# Altium schematic sheet DASHBOARD.SchDoc
size A4; SheetNumber: 1; SheetTotal: 4
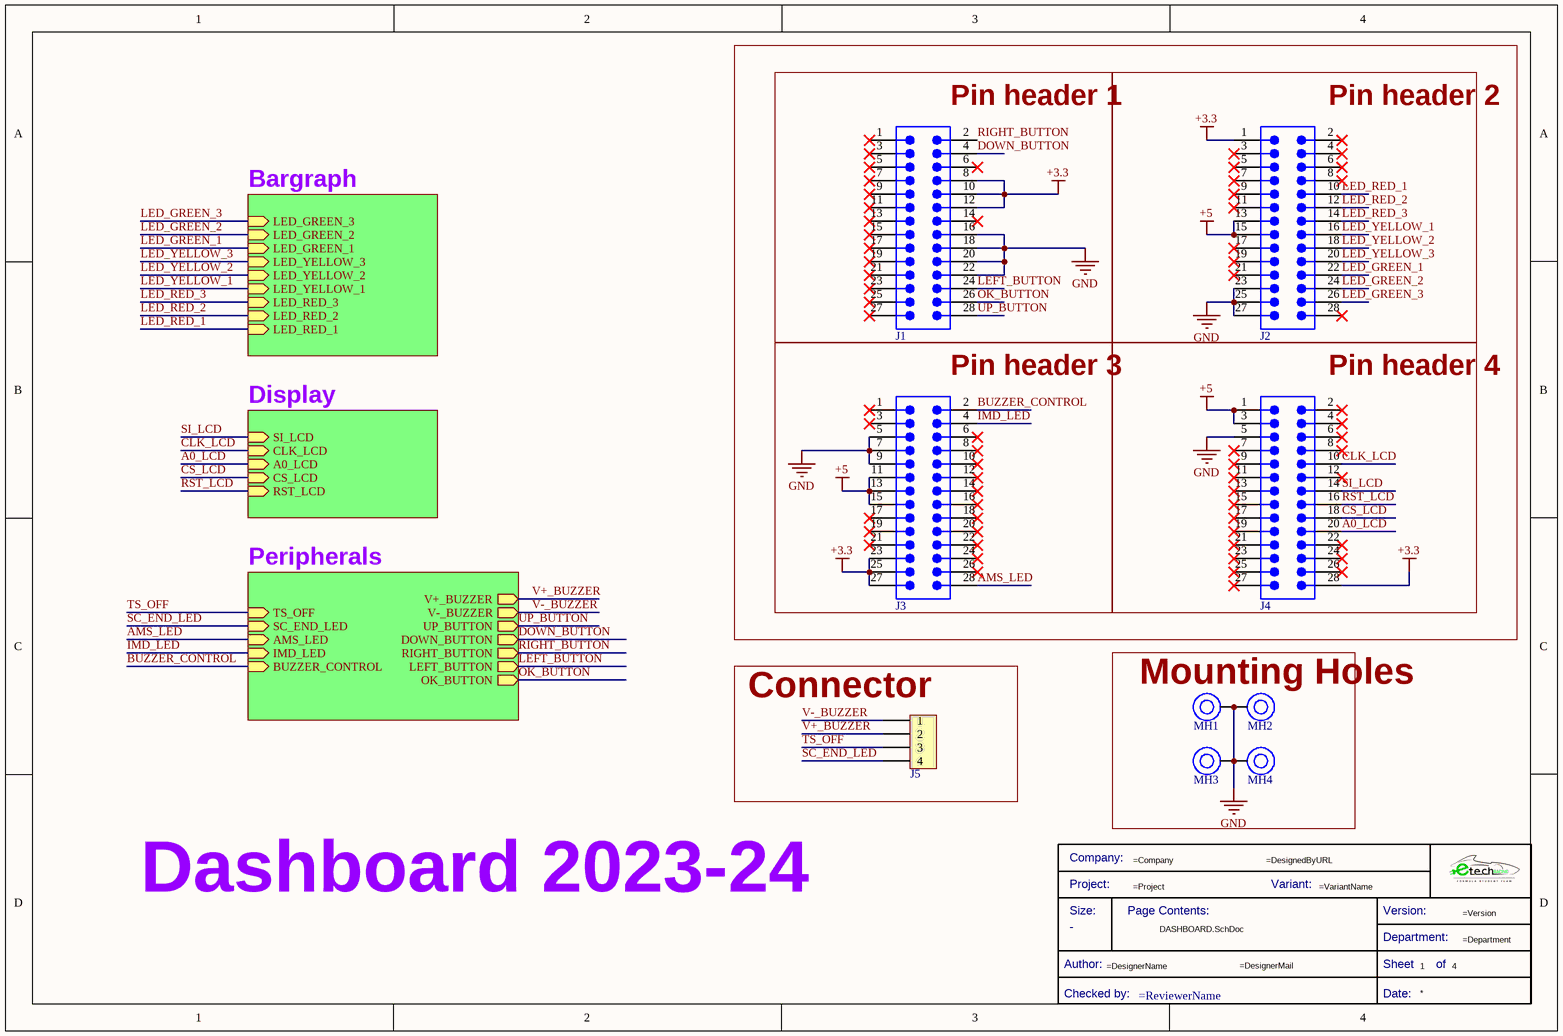
[diagram p0: DASHBOARD.SchDoc]

## Parts
*  Title Block_template  (value not drawn)  (graphical)
J1  62132821021  [62132821021]  (value not drawn)
J2  62132821021  [62132821021]  (value not drawn)
J3  62132821021  [62132821021]  (value not drawn)
J4  62132821021  [62132821021]  (value not drawn)
J5  436500400  [J_MicroFit_1x4]  (value not drawn)
MH1  Mounting_Hole_M3  [Mounting_Hole_M3]  (value not drawn)
MH2  Mounting_Hole_M3  [Mounting_Hole_M3]  (value not drawn)
MH3  Mounting_Hole_M3  [Mounting_Hole_M3]  (value not drawn)
MH4  Mounting_Hole_M3  [Mounting_Hole_M3]  (value not drawn)

## Blocks framed on the sheet
Pin header 1: J1
Pin header 2: J2
Pin header 3: J3
Pin header 4: J4
Connector: J5
Mounting Holes: MH1-MH4

## Sub-sheets
Bargraph = Bargraph: LED_GREEN_3 (in), LED_GREEN_2 (in), LED_GREEN_1 (in), LED_YELLOW_3 (in), LED_YELLOW_2 (in), LED_YELLOW_1 (in), LED_RED_3 (in), LED_RED_2 (in), LED_RED_1 (in)
Display = Display: SI_LCD (in), CLK_LCD (in), A0_LCD (in), CS_LCD (in), RST_LCD (in)
Peripherals = Peripherals.SchDoc: AMS_LED (in), IMD_LED (in), UP_BUTTON (out), DOWN_BUTTON (out), RIGHT_BUTTON (out), LEFT_BUTTON (out), OK_BUTTON (out), V+_BUZZER (out), V-_BUZZER (out), SC_END_LED (in), TS_OFF (in), BUZZER_CONTROL (in)

## Nets
+3.3: J1.8 J1.10 J1.12 J2.1 J3.23 J3.25 J3.27 J4.28
+5: J2.13 J2.15 J3.11 J3.13 J3.15 J4.1 J4.3
GND: J1.16 J1.18 J1.20 J1.22 J2.23 J2.25 J2.27 J3.5 J3.7 J3.9 J4.5 MH1.1 MH2.1 MH3.1 MH4.1
A0_LCD: J4.20 ; sheet Display/A0_LCD
AMS_LED: J3.28 ; sheet Peripherals/AMS_LED
BUZZER_CONTROL: J3.2 ; sheet Peripherals/BUZZER_CONTROL
CLK_LCD: J4.10 ; sheet Display/CLK_LCD
CS_LCD: J4.18 ; sheet Display/CS_LCD
DOWN_BUTTON: J1.4 ; sheet Peripherals/DOWN_BUTTON
IMD_LED: J3.4 ; sheet Peripherals/IMD_LED
LED_GREEN_1: J2.22 ; sheet Bargraph/LED_GREEN_1
LED_GREEN_2: J2.24 ; sheet Bargraph/LED_GREEN_2
LED_GREEN_3: J2.26 ; sheet Bargraph/LED_GREEN_3
LED_RED_1: J2.10 ; sheet Bargraph/LED_RED_1
LED_RED_2: J2.12 ; sheet Bargraph/LED_RED_2
LED_RED_3: J2.14 ; sheet Bargraph/LED_RED_3
LED_YELLOW_1: J2.16 ; sheet Bargraph/LED_YELLOW_1
LED_YELLOW_2: J2.18 ; sheet Bargraph/LED_YELLOW_2
LED_YELLOW_3: J2.20 ; sheet Bargraph/LED_YELLOW_3
LEFT_BUTTON: J1.24 ; sheet Peripherals/LEFT_BUTTON
OK_BUTTON: J1.26 ; sheet Peripherals/OK_BUTTON
RIGHT_BUTTON: J1.2 ; sheet Peripherals/RIGHT_BUTTON
RST_LCD: J4.16 ; sheet Display/RST_LCD
SC_END_LED: J5.4 ; sheet Peripherals/SC_END_LED
SI_LCD: J4.14 ; sheet Display/SI_LCD
TS_OFF: J5.3 ; sheet Peripherals/TS_OFF
UP_BUTTON: J1.28 ; sheet Peripherals/UP_BUTTON
V+_BUZZER: J5.2 ; sheet Peripherals/V+_BUZZER
V-_BUZZER: J5.1 ; sheet Peripherals/V-_BUZZER

Not connected (* = marked no-connect by the designer): J1 1* 3* 5* 6* 7* 9* 11* 13* 14* 15* 17* 19* 21* 23* 25* 27*; J2 2* 3* 4* 5* 6* 7* 8* 9* 11* 17* 19* 21* 28*; J3 1* 3* 6* 8* 10* 12* 14* 16* 17* 18* 19* 20* 21* 22* 24* 26*; J4 2* 4* 6* 7* 8* 9* 11* 12* 13* 15* 17* 19* 21* 22* 23* 24* 25* 26* 27*

## Notes on the sheet
- Dashboard 2023-24
- (in symbol Title Block_template) Company:; Project:; Variant:; Size:; Page Contents:; Version:; Department:; Author:; Sheet; of; Checked by:; Date:

## Library data of the parts
* = Title Block_template: Standard Title Block; .Creator: GP; Category: Title Block; .PCBcheck: GP; .SCHcheck: GP; Checked by:: =ReviewerName; Size: -
J1-J4 = 62132821021: WR-PHD Pin Header, SMT, Vertical, pitch 1.27mm, 2 Row, 28P; Manufacturer: Wurth Elektronik; Contact Resistance: 20mΩ; Rated Current: 1A; Working Voltage: 100V; Withstanding Voltage: 500V; ComponentLink1Description: Website Link; ComponentLink1URL: https://www.we-online.com/redexpert/article/62132821021?ad; ComponentLink2Description: Datasheet Link; ComponentLink2URL: https://www.we-online.com/redexpert/spec/62132821021?ad; Manufacturer Part Number: 62132821021; Category: Board-to-Board Connectors; Match Code: WR-PHD; Mount: Surface Mount; Operating Temperature Max: 105°C; Operating Temperature Min: -40°C; Packaging: Tape and Reel; Gender: Pin Header; Number of Pins: 28; Number of Rows: 2; Orientation: Vertical; Pitch: 1.27mm
J5 = J_MicroFit_1x4: Connector Wire to Board Header 4 Position 3mm Solder Right Angle Thru-Hole Tray; Manufacturer 1: Molex; Manufacturer Part Number 1: 43650-0400; Current Rating: 5A; Voltage Rating: 600V; Contact Resistance: 10mR; Connector Type: Plug; Number of Positions: 4; Gender: Male; Voltage Rating (DC): 250V; Glow Wire Compliant: Compliant; Supplier 1: Farnell; RoHS: Yes; Category: Headers and Wire Housings; Stock 1: 4623; Pricing 1: 1=1,24000, 10=1,22000, 50=1,19000, 100=1,17000, 500=1,14000, 1000=1,12000 (EUR); Mount: Through Hole,Cable; Contact Material: Brass,Copper Alloy; Contact Plating: Tin; Color: Black; Housing Color: Black; Housing Material: Thermoplastic; Min Operating Temperature: -40°C; Max Operating Temperature: 105°C; Termination: Solder; Orientation: Right Angle; Number of Rows: 1; Packaging: Tray; Package Quantity: 2380; Number of Contacts: 4; Max Voltage Rating (AC): 600V; Number of Circuits: 4; Series: 43650; Length: 14.86mm; Height: 4.5mm; Pitch: 3mm; Depth: 3.6mm; Radiation Hardening: No; Halogen Free: Low Halogen; Lead Free: Contains Lead; Flammability Rating: UL94 V-0; RoHS Compliant: Yes; ComponentLink1URL: https://datasheet.ciiva.com/19462/884184-19462234.pdf?src-supplier=Jameco; ComponentLink1Description: https://datasheet.ciiva.com/19462/884184-19462234.pdf?src-supplier=Jameco; ComponentLink2URL: https://datasheet.ciiva.com/5151/0436500400-pcb-headers-148663-5151881.pdf?src-supplier=Mouser; ComponentLink2Description: https://datasheet.ciiva.com/5151/0436500400-pcb-headers-148663-5151881.pdf?src-supplier=Mouser; ComponentLink3URL: https://datasheet.ciiva.com/16085/0436500400-pcb-headers-16085752.pdf?src-supplier=Onlinecomponents.com; ComponentLink3Description: https://datasheet.ciiva.com/16085/0436500400-pcb-headers-16085752.pdf?src-supplier=Onlinecomponents.com; ComponentLink4URL: https://datasheet.ciiva.com/11748/0900766b80d6135b-11748178.pdf?src-supplier=RSComponents; ComponentLink4Description: https://datasheet.ciiva.com/11748/0900766b80d6135b-11748178.pdf?src-supplier=RSComponents; ComponentLink5URL: https://datasheet.ciiva.com/30221/142510436500400-pcb-headers-30221164.pdf?src-supplier=Onlinecomponents.com; ComponentLink5Description: https://datasheet.ciiva.com/30221/142510436500400-pcb-headers-30221164.pdf?src-supplier=Onlinecomponents.com; ComponentLink6URL: https://datasheet.ciiva.com/17080/70266896-17080471.pdf?src-supplier=Allied+Electronics; ComponentLink6Description: https://datasheet.ciiva.com/17080/70266896-17080471.pdf?src-supplier=Allied+Electronics; ComponentLink7URL: https://datasheet.ciiva.com/7094/1946229-7094763.pdf?src-supplier=Newark; ComponentLink7Description: https://datasheet.ciiva.com/7094/1946229-7094763.pdf?src-supplier=Newark; ComponentLink8URL: https://datasheet.ciiva.com/9449/0436500400-pcb-headers-9449446.pdf?src-supplier=Avnet; ComponentLink8Description: https://datasheet.ciiva.com/9449/0436500400-pcb-headers-9449446.pdf?src-supplier=Avnet; Supplier Part Number 1: 1012232